# Altium schematic sheet 00-MAIN-TRAP.SchDoc
size A4
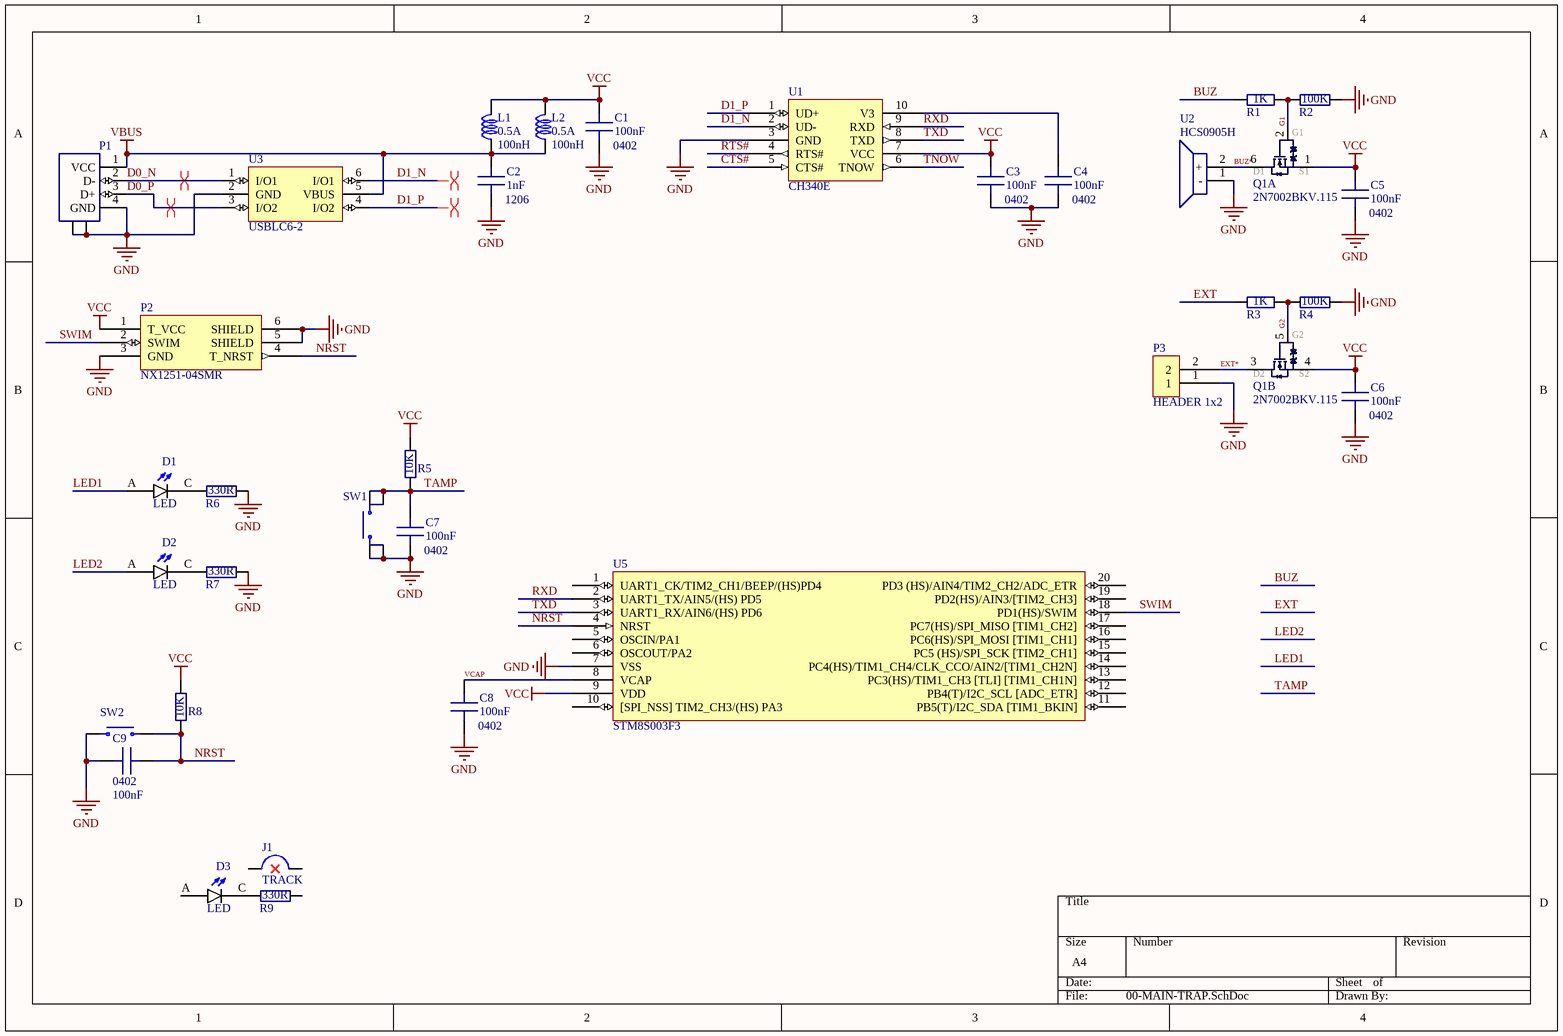
[diagram p0: 00-MAIN-TRAP.SchDoc]

## Parts
C1  Size: 0402  [C0402_NOSILK]  (hidden comment: 100nF)
C2  Size: 1206  [C1206]  (hidden comment: 1nF)
C3  Size: 0402  [C0402_NOSILK]  (hidden comment: 100nF)
C4  Size: 0402  [C0402_NOSILK]  (hidden comment: 100nF)
C5  Size: 0402  [C0402_NOSILK]  (hidden comment: 100nF)
C6  Size: 0402  [C0402_NOSILK]  (hidden comment: 100nF)
C7  Size: 0402  [C0402_NOSILK]  (hidden comment: 100nF)
C8  Size: 0402  [C0402_NOSILK]  (hidden comment: 100nF)
C9  Size: 0402  [C0402_NOSILK]  (hidden comment: 100nF)
D1  LED  [LED_0805_INVERTED]
D2  LED  [LED_0805_INVERTED]
D3  LED  [LED_0805_INVERTED]
J1  TRACK  [TRACK-2x0.5MM]  (no BOM)
L1  Current: 0.5A  Inductivity: 100nH  [L0603]  (hidden comment: *)
L2  Current: 0.5A  Inductivity: 100nH  [L0603]  (hidden comment: *)
P1  440247-2  [USB A type r/a male SMT]  (value not drawn)
P2  NX1251-04SMR  [NX1251-04SMR]
P3  HEADER 1x2  [HEADER 1x2 2.54]
Q1  2N7002BKV.115  [SOT-666]  (parts A,B of 2)
R1  Resistance: 1K  [R0402_NOSILK]
R2  Resistance: 100K  [R0402_NOSILK]
R3  Resistance: 1K  [R0402_NOSILK]
R4  Resistance: 100K  [R0402_NOSILK]
R5  Resistance: 10K  [R0402_NOSILK]
R6  Resistance: 330R  [R0402_NOSILK]
R7  Resistance: 330R  [R0402_NOSILK]
R8  Resistance: 10K  [R0402_NOSILK]
R9  Resistance: 330R  [R0402_NOSILK]
SW1  SWITCH_GEN_4P  [SW_4x4x1.5]  (value not drawn)
SW2  SWITCH_GEN_2P  [SW_3x4x2]  (value not drawn)
U1  CH340E  [MSOP-10]
U2  HCS0905H  [HCS09H]
U3  USBLC6-2  [SOT-666]
U5  STM8S003F3  [TSSOP20-6.5x4.4-0.65p]

## Nets
GND: C1.1 C2.1 C3.1 C4.1 C5.1 C6.1 C7.1 C8.1 C9.2 P1.4(GND) P1.SHIELD P2.3(GND) P2.5(SHIELD) P2.6(SHIELD) P3.1 R2.2 R4.2 R6.2 R7.2 SW1.1 SW1.3 SW2.1 U1.3(GND) U2.1(-) U3.2(GND) U5.7(VSS)
VBUS: C2.2 L1.1 L2.1 P1.1(VCC) U3.5(VBUS)
VCC: C1.2 C3.2 C5.2 C6.2 L1.2 L2.2 P2.1(T_VCC) Q1.1(S1) Q1.4(S2) R5.2 R8.2 U1.7(VCC) U5.9(VDD)
BUZ: R1.1
BUZ*: Q1.6(D1) U2.2(+)
CTS#: U1.5(CTS#)
D0_N: P1.2(D-) U3.1(I/O1)
D0_P: P1.3(D+) U3.3(I/O2)
D1_N: U1.2(UD-) U3.6(I/O1)
D1_P: U1.1(UD+) U3.4(I/O2)
EXT: R3.1
EXT*: P3.2 Q1.3(D2)
G1: Q1.2(G1) R1.2 R2.1
G2: Q1.5(G2) R3.2 R4.1
LED1: D1.A
LED2: D2.A
NRST: C9.1 P2.4(T_NRST) R8.1 SW2.2 U5.4(NRST)
RTS#: U1.4(RTS#)
RXD: U1.9(RXD) U5.2(UART1_TX/AIN5/(HS)_PD5)
SWIM: P2.2(SWIM) U5.18(PD1(HS)/SWIM)
TAMP: C7.2 R5.1 SW1.2 SW1.4
TNOW: U1.6(TNOW)
TXD: U1.8(TXD) U5.3(UART1_RX/AIN6/(HS)_PD6)
VCAP: C8.2 U5.8(VCAP)
NetC4_2: C4.2 U1.10(V3)
NetD1_C: D1.C R6.1
NetD2_C: D2.C R7.1
NetD3_C: D3.C R9.1

Not connected (* = marked no-connect by the designer): D3 A; J1 1 2; R9 2; U5 1(UART1_CK/TIM2_CH1/BEEP/(HS)PD4) 5(OSCIN/PA1) 6(OSCOUT/PA2) 10([SPI_NSS]_TIM2_CH3/(HS)_PA3) 11(PB5(T)/I2C_SDA_[TIM1_BKIN]) 12(PB4(T)/I2C_SCL_[ADC_ETR]) 13(PC3(HS)/TIM1_CH3_[TLI]_[TIM1_CH1N]) 14(PC4(HS)/TIM1_CH4/CLK_CCO/AIN2/[TIM1_CH2N]) 15(PC5_(HS)/SPI_SCK_[TIM2_CH1]) 16(PC6(HS)/SPI_MOSI_[TIM1_CH1]) 17(PC7(HS)/SPI_MISO_[TIM1_CH2]) 19(PD2(HS)/AIN3/[TIM2_CH3]) 20(PD3_(HS)/AIN4/TIM2_CH2/ADC_ETR)

## Layout directives
differential pair; differential pair class USB: D0_N, D0_P, D1_N, D1_P

## Library data of the parts
C1 C3-C9 = C0402_100nF_16V: Ceramic capacitor; Voltage: 16V; Capacity: 100nF; PriceRCSUAH: 0,2; RCS: https://www.rcscomponents.kiev.ua/product/100nf-16v-10-x7r-0402-cl05b104ko5nnnc-samsung_103686.html; Value: 100nF
C2 = C1206_1nF_2KV: Ceramic capacitor; Voltage: 2KV; Capacity: 1nF; PriceRCSUAH: 1,7; RCS: https://www.rcscomponents.kiev.ua/product/1nf-2000v-x7r-10-1206-3k-reel-1206b102k202n3-hitano-kondensatory-keramicheskie-smd_11455.html; Value: 1nF
D1-D3 = LED: Led General; MF: Dialight; MP: 598-8140-107F; Owned: 3000; SnapEDA_Link: https://www.snapeda.com/parts/598-8140-107F/Dialight/view-part/?ref=snap; Price: None; Availability: Unavailable; Package: 0805 Dialight; Value: *
J1 = TRACK: An exposed track to cut/solder
L1 L2 = L_0603_100nH_0.5A: Inductor Generic; Value: *; Size: 0603; Url: *; PriceKosmodromUAH: *; Kosmodrom: *
P1 = CON-USB-A: Mini/Micro USB B Type RCPT; Availability: Unavailable; Package: None; Price: None; Value: *; PriceKosmodromUAH: 0; Kosmodrom: http://www.kosmodrom.com.ua/; MF: *
Q1 = 2N7002BKV.115: 60 V, 340 mA dual N-channel Trench MOSFET; Kosmodrom: http://www.kosmodrom.com.ua/el.php?name=2N7002BKV.115; PriceKosmodromUAH: 3.5
R1 R3 = R0402_1K: Resistor General; Tolerance: 5%; Size: 0402; PriceRCSUAH: *; RCS: *
R2 R4 = R0402_100K: Resistor General; Tolerance: 5%; Size: 0402; RCS: *; PriceRCSUAH: *
R5 R8 = R0402_10K: Resistor General; Tolerance: 5%; Size: 0402; RCS: *; PriceRCSUAH: *
R6 R7 R9 = R0402_330R: Resistor General; Tolerance: 5%; Size: 0402; RCS: *; PriceRCSUAH: *
SW1 = SWITCH_GEN_4P: SWITCH DIP 4.3 mm; PriceKosmodromUAH: 0,5; Kosmodrom: http://www.kosmodrom.com.ua/el.php?name=TACT-5X5X1.5
SW2 = SWITCH_GEN_2P: SWITCH DIP 4.3 mm; PriceKosmodromUAH: 1,25; Kosmodrom: http://www.kosmodrom.com.ua/el.php?name=TACT-35N-F
U2 = HCS0905H: 5V Buzzer GEN
U3 = USBLC6-2: Very low capacitance ESD protection; PriceKosmodromUAH: 4,25; Kosmodrom: http://www.kosmodrom.com.ua/el.php?name=USBLC6-2P6
U5 = STM8S003F3: Cheap 8bit MCU
P2 = NX1251-04SMR: Kosmodrom: http://www.kosmodrom.com.ua/el.php?name=NX1251-04SMR; PriceKosmodromUAH: 5.5